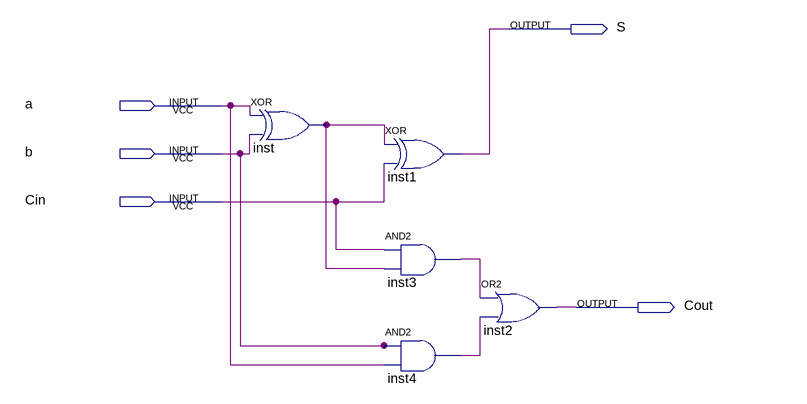
[diagram p0: schematic sheet]
// Quartus schematic fulladder.bdf as structural Verilog: 5 symbols, 5 pins
module fulladder (
  input  a,
  input  b,
  input  Cin,
  output S,
  output Cout
);

  wire inst3_out, inst4_out, inst_out;

  xor inst (inst_out, a, b);
  xor inst1 (S, inst_out, Cin);
  and inst3 (inst3_out, Cin, inst_out);
  and inst4 (inst4_out, b, a);
  or inst2 (Cout, inst3_out, inst4_out);
endmodule
